# Altium schematic sheet ConnectorIn.SchDoc
size A4
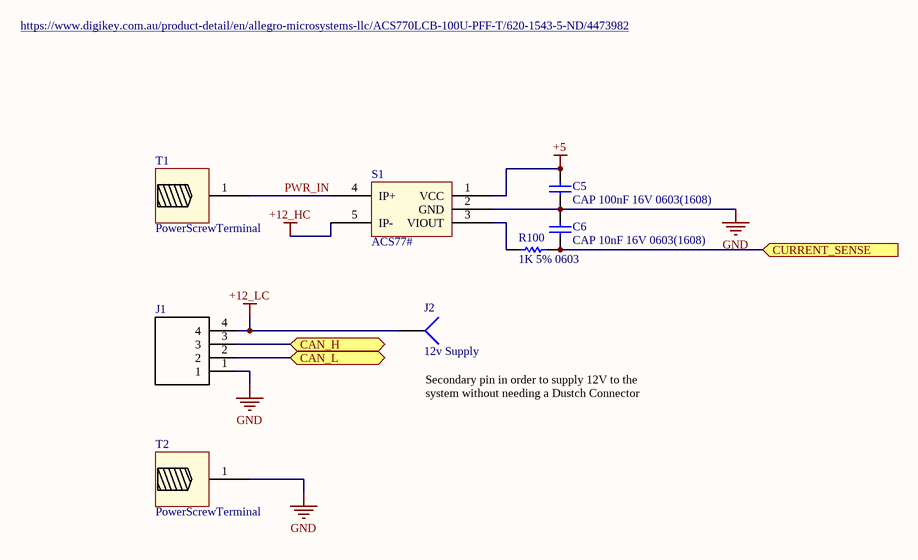
[diagram p0: ConnectorIn.SchDoc]

## Parts
C5  CAP 100nF 16V 0603(1608)  [CAPC0603(1608)100_M]
C6  CAP 10nF 16V 0603(1608)  [CAPC0603(1608)100_M]
J1  DT15-4P  [TE_DT15-4P]  (value not drawn)
J2  12v Supply  [PIN1]
R100  1K 5% 0603  [RESC0603(1608)_L]
S1  ACS77#  [ACS77#]
T1  PowerScrewTerminal  [WE_REDCUBE_74650195R]
T2  PowerScrewTerminal  [WE_REDCUBE_74650195R]

## Ports
CAN_H (bidir), CAN_L (bidir), CURRENT_SENSE (in)

## Nets
+5: C5.2 S1.1(VCC)
+12_HC: S1.5(IP-)
+12_LC: J1.4 J2.1
GND: C5.1 C6.2 J1.1 S1.2(GND) T2.1
CAN_H: J1.3 ; port CAN_H
CAN_L: J1.2 ; port CAN_L
CURRENT_SENSE: C6.1 R100.1 ; port CURRENT_SENSE
PWR_IN: S1.4(IP+) T1.1
NetR100_2: R100.2 S1.3(VIOUT)

## Notes on the sheet
- https://www.digikey.com.au/product-detail/en/allegro-microsystems-llc/ACS770LCB-100U-PFF-T/620-1543-5-ND/4473982
- (near J2) Secondary pin in order to supply 12V to the system without needing a Dustch Connector
- Title
- Size:
- Date:
- A4
- Number:
- Time:
- Revision:
- Sheet
- of
- File:

## Library data of the parts
C5 = CMP-1035-02583-1: CAP 100nF 16V ±5% 0603 (1608 Metric) Thickness 1mm SMD; Tolerance: Â±5%; Case-Metric: 1608; Case-EIA: 0603; Rated Voltage: 16 V; Max Thickness: 1 mm; Technology: SMT; Value: 100nF
C6 = CMP-1035-02310-1: CAP 10nF 16V ±5% 0603 (1608 Metric) Thickness 1mm SMD; Case-Metric: 1608; Case-EIA: 0603; Tolerance: Â±5%; Technology: SMT; Value: 10nF; Rated Voltage: 16 V; Max Thickness: 1 mm
J1 = DT15-4P: DT Series 4 Position 16 AWG Flange Mount Male Pin Through Hole Receptacle Header; MF: TE Connectivity; Package: None; Digi-Key_Purchase_URL: https://www.digikey.com/product-detail/en/te-connectivity-deutsch-connectors/DT15-4P/1734-1030-ND/6566594?utm_source=snapeda&utm_medium=aggregator&utm_campaign=symbol; MP: DT15-4P; TE_purchase_URL: https://www.te.com/usa-en/product-DT15-4P.html?te_bu=Cor&te_type=disp&te_campaign=seda_glo_cor-seda-global-disp-prtnr-fy19-seda-model-bom-cta_sma-317_1&elqCampaignId=32493; Digi-Key_Part_Number: 1734-1030-ND; SnapEDA_Link: https://www.snapeda.com/parts/DT15-4P/TE%20Connectivity%20Deutsch%20Connectors/view-part/?ref=snap; Value: *
J2 = Socket: LatestRevisionDate: 17-Jul-2002; LatestRevisionNote: Re-released for DXP Platform.; Publisher: Altium Limited
R100 = CMP-1012-00074-1: 1K 0.1W 5% 0603 (1608 Metric)  SMD; Case-EIA: 0603; Case-Metric: 1608; Value: 1000.00 Ohm; Technology: SMT; Tolerance: 5 %; Power: 0.1 W